# EAGLE design Flasherrev2 (EAGLE 7.5.0)
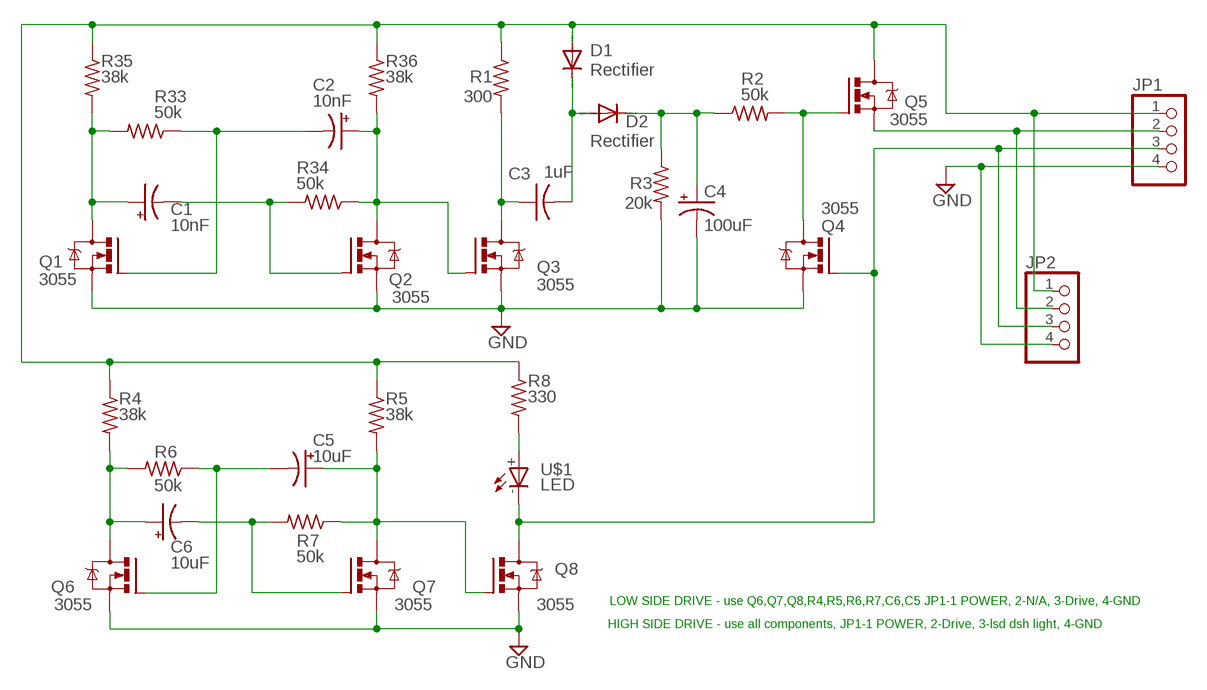
[diagram p0: schematic, sheet 1]

## Parts
C1  10nF  CPOL-USCT3528  [CT3528]
C2  10nF  CPOL-USCT3528  [CT3528]
C3  1uF  CAPACITOR-NO-POLARITYC1206  [C1206]
C4  100uF  CPOL-USF  [PANASONIC_F]
C5  10uF  CPOL-USCT3528  [CT3528]
C6  10uF  CPOL-USCT3528  [CT3528]
D1  Rectifier  DIODE-DO-214AC  [DO-214AC]
D2  Rectifier  DIODE-DO-214AC  [DO-214AC]
JP1  PINHD-1X4  [1X04]
JP2  PINHD-1X4  [1X04]
Q1  3055  MTP3055VSOIC  [SOT223R_INFINEON]
Q2  3055  MTP3055VSOIC  [SOT223R_INFINEON]
Q3  3055  MTP3055VSOIC  [SOT223R_INFINEON]
Q4  3055  MTP3055VSOIC  [SOT223R_INFINEON]
Q5  3055  MTP3055V  [TO220BV]
Q6  3055  MTP3055VSOIC  [SOT223R_INFINEON]
Q7  3055  MTP3055VSOIC  [SOT223R_INFINEON]
Q8  3055  MTP3055V  [TO220BV]
R1  300  RESISITORR1206  [R1206]
R2  50k  RESISITORR1206  [R1206]
R3  20k  RESISITORR1206  [R1206]
R4  38k  RESISITORR1206  [R1206]
R5  38k  RESISITORR1206  [R1206]
R6  50k  RESISITORR1206  [R1206]
R7  50k  RESISITORR1206  [R1206]
R8  330  RESISITORR1206  [R1206]
R33  50k  RESISITORR1206  [R1206]
R34  50k  RESISITORR1206  [R1206]
R35  38k  RESISITORR1206  [R1206]
R36  38k  RESISITORR1206  [R1206]
U$1  LED  [1206]

## Nets
GND: C4.- JP1.4 JP2.4 Q1.3(S) Q2.3(S) Q3.3(S) Q4.3(S) Q6.3(S) Q7.3(S) Q8.S R3.2
N$1: C4.+ D2.C R2.1 R3.1
N$2: C3.2 D1.C D2.A
N$3: JP1.3 JP2.3 Q4.1(G) Q8.D U$1.-
N$4: JP1.2 JP2.2 Q5.S
N$5: R8.2 U$1.+
N$6: Q4.2(D) Q5.G R2.2
N$8: C6.+ Q6.2(D) R4.2 R6.2
N$10: C5.- Q6.1(G) R6.1
N$11: C1.+ Q1.2(D) R33.2 R35.2
N$12: C2.+ Q2.2(D) Q3.1(G) R34.1 R36.2
N$13: C6.- Q7.1(G) R7.2
N$14: C2.- Q1.1(G) R33.1
N$15: C1.- Q2.1(G) R34.2
N$18: C5.+ Q7.2(D) Q8.G R5.2 R7.1
N$37: D1.A JP1.1 JP2.1 Q5.D R1.1 R4.1 R5.1 R8.1 R35.1 R36.1
N$42: C3.1 Q3.2(D) R1.2

## Notes on the sheet
- LOW SIDE DRIVE - use Q6,Q7,Q8,R4,R5,R6,R7,C6,C5 JP1-1 POWER, 2-N/A, 3-Drive, 4-GND
- HIGH SIDE DRIVE - use all components, JP1-1 POWER, 2-Drive, 3-lsd dsh light, 4-GND

## Library data of the parts
C1 C2 C4-C6 = rcl:CPOL-US: POLARIZED CAPACITOR, American symbol
C3 = 1 Dan's Common Parts:CAPACITOR-NO-POLARITY: CAPACITOR, American symbol
D1 D2 = diode:DIODE-: DIODE
JP1 JP2 = pinhead:PINHD-1X4: PIN HEADER
Q1-Q8 = 1 Dan's Common Parts:MTP3055V: N-CHANNEL MOS FET
R1-R8 R33-R36 = 1 Dan's Common Parts:RESISITOR: RESISTOR, American symbol
U$1 = 1 Dan's Common Parts:LED

## Board
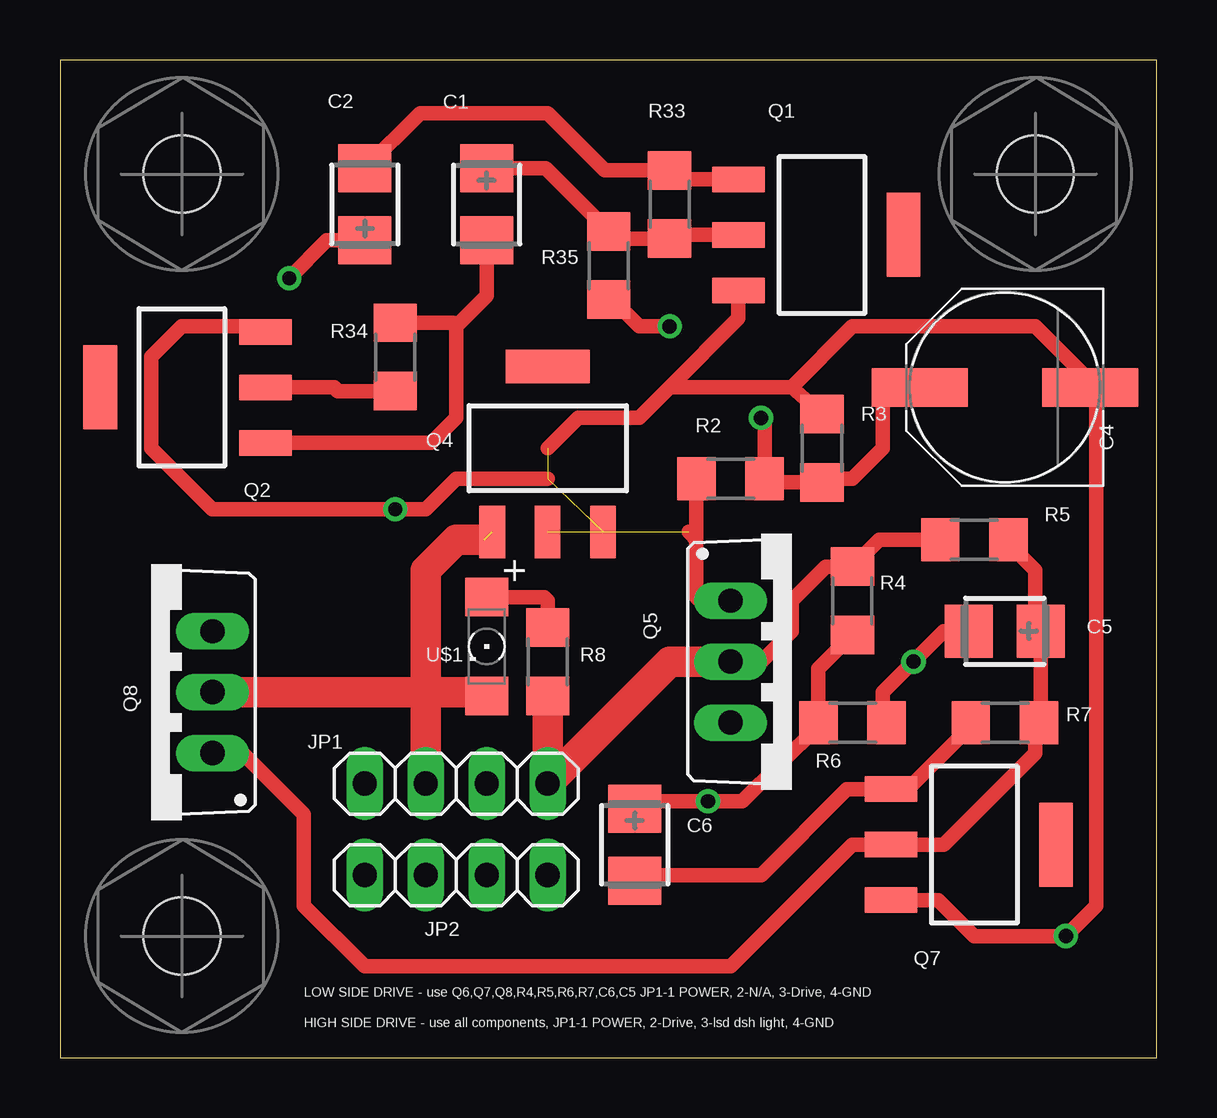
[diagram p1: board, top side]
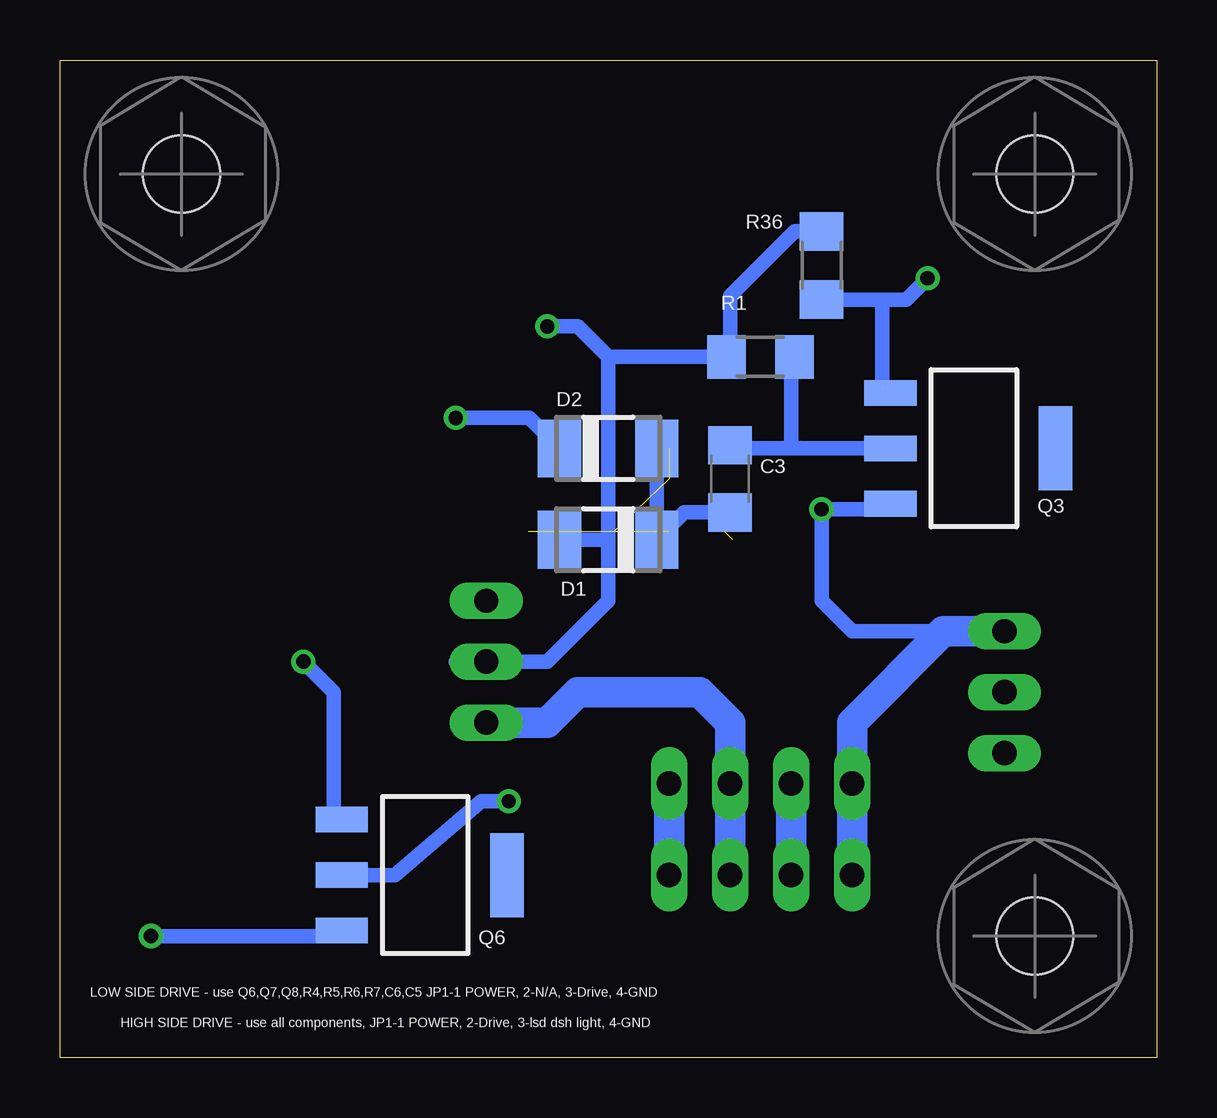
[diagram p2: board, bottom side, seen from below]

Size 45.7 x 41.58 mm. Coordinates in mm from the lower left corner, seen from the top.
Outline: 0,0 45.7,0 45.7,41.58 0,41.58 0,0
Copper layers (1*16): Top 0.035mm / dielectric 1.5mm / Bottom 0.035mm
Design rules "default *": minimum track width 10mil, minimum drill 20mil, track to track 8mil, track to pad 8mil, pad to pad 8mil, via to via 8mil, smd to smd 8mil, copper to edge 40mil, drill to drill 8mil, minimum pad ring 10mil, minimum via ring 8mil, stop-mask expansion 4mil, vias tented up to drill 0mil, thermal gap 10mil

### Footprints (pad centres in the part's own frame; a part is rotated, then mirrored left to right if it is on the bottom)
CT3528 = smd 2 x 2.2: + 1.5,0; - -1.5,0
C1206 = smd 1.6 x 1.8: 1 -1.4,0; 2 1.4,0
PANASONIC_F = smd 4 x 1.6: + 3.55,0; - -3.55,0
DO-214AC = smd 1.8 x 2.4: A 2.025,0; C -2.025,0
1X04 = drill 1.016 long: 1 -3.81,0; 2 -1.27,0; 3 1.27,0; 4 3.81,0
SOT223R_INFINEON = smd 1.067 x 2.184: 1 -2.311,-3.479; 2 0,-3.48; 3 2.312,-3.48 | smd 3.5 x 1.4: 4 0,3.404
TO220BV = drill 1.016 long: D 0,-2.54; G -2.54,-2.54; S 2.54,-2.54
R1206 = smd 1.6 x 1.803: 1 -1.422,0; 2 1.422,0
1206 = smd 1.6 x 1.803: + -1.422,0; - 2.692,0
SCREW = hole 3.2: 0,0

### Placement (x,y rotation side)
C1  17.78,35.56 90 top
C2  12.7,35.56 270 top
C3  17.78,24.13 270 bottom
C4  39.37,27.94 180 top
C5  39.37,17.78 0 top
C6  23.95,8.89 90 top
D1  22.86,21.59 180 bottom
D2  22.86,25.4 0 bottom
JP1  16.51,11.43 180 top
JP2  16.51,7.62 180 top
Q1  31.75,34.29 270 top
Q2  5.08,27.94 90 top
Q3  7.62,25.4 270 bottom
Q4  20.32,25.4 0 top
Q5  30.48,16.51 270 top
Q6  30.48,7.62 270 bottom
Q7  38.1,8.89 270 top
Q8  3.81,15.24 90 top
R1  16.51,29.21 0 bottom
R2  27.94,24.13 180 top
R3  31.75,25.4 90 top
R4  33.02,19.05 270 top
R5  38.1,21.59 0 top
R6  33.02,13.97 180 top
R7  39.37,13.97 180 top
R8  20.32,16.51 90 top
R33  25.4,35.56 270 top
R34  13.97,29.21 90 top
R35  22.86,33.02 90 top
R36  13.97,33.02 270 bottom
U$1  17.78,17.78 270 top
U$2  [SCREW]  5.08,5.08 0 top
U$3  [SCREW]  5.08,36.83 0 top
U$4  [SCREW]  40.64,36.83 0 top

### Tracks (layer width: path | path; a pad name or v marks a point on that pad's centre or on a via)
GND  (via drill 0.6)  (2 unrouted)
  Top 0.61: Q2.3 8.33,30.48 5.08,30.48 3.81,29.21 3.81,25.4 6.35,22.86 v13.97,22.86 15.24,22.86 16.51,24.13 20.32,24.13 | 20.32,25.4 21.59,26.67 24.13,26.67 25.4,27.94 | 20.32,24.13 | Q7.3 36.6,6.58 38.1,5.08 v41.91,5.08 43.18,6.35 43.18,27.68 C4.- 42.92,28.2 40.64,30.48 33.02,30.48 30.48,27.94 | Q1.3 28.27,30.81 25.4,27.94 | R3.2 30.48,27.94 | 30.48,27.94 25.4,27.94
  Bottom 0.61: v41.91,5.08 34.29,5.08 | 34.29,5.08 34.19,5.08 Q6.3 34.06,5.31 34.29,5.08 | Q3.3 11.33,22.86 v13.97,22.86 13.97,19.05 12.7,17.78 Q8.S
  Bottom 1.27: Q8.S 8.89,17.78 12.7,13.97 JP1.4 JP2.4
N$1  (via drill 0.6)
  Top 0.61: v29.21,26.67 29.36,26.52 R2.1 29.36,23.98 R3.1 31.9,24.13 33.02,24.13 34.29,25.4 34.29,27.94 C4.+
  Bottom 0.61: D2.C 26.16,26.67 v29.21,26.67
N$2
  Bottom 0.61: D2.A D1.C 19.7,22.73 C3.2
N$3  (1 unrouted)
  Top 1.27: JP1.3 15.24,15.24 | 15.24,15.24 Q8.D | U$1.- 17.63,15.24 | 17.78,15.24 17.63,15.24 | 17.63,15.24 15.24,15.24 | 15.24,15.24 15.24,20.32 16.51,21.59 17.68,21.59
  Bottom 1.27: JP2.3 JP1.3
N$4
  Bottom 1.27: Q5.S 25.4,13.97 24.13,15.24 19.05,15.24 17.78,13.97 JP1.2 JP2.2
N$5
  Top 0.61: U$1.+ 20.17,19.2 20.32,19.05 R8.2
N$6  (1 unrouted)
  Top 0.61: R2.2 26.52,21.59 | 26.52,21.59 26.52,19.2 26.67,19.05 Q5.G | 26.19,21.92 26.52,21.59
N$8  (via drill 0.6)
  Top 0.61: R4.2 31.6,16.21 R6.2 31.6,13.82 28.42,10.69 v27,10.69 24.99,10.69 C6.+
  Bottom 0.61: Q6.2 31.75,7.62 28.14,10.69 v27,10.69
N$10  (via drill 0.6)
  Top 0.61: R6.1 34.29,13.97 34.29,15.24 v35.56,16.51 36.83,17.78 C5.-
  Bottom 0.61: v35.56,16.51 34.29,15.24 34.29,10.16 34.19,10.16 Q6.1
N$11
  Top 0.61: Q1.2 25.55,34.29 R33.2 23.16,34.14 R35.2 20.24,37.06 C1.+
N$12  (via drill 0.6)  (1 unrouted)
  Top 0.61: R34.1 11.58,27.79 11.43,27.94 Q2.2 | 12.7,34.29 C2.+ 11.12,34.06 v9.55,32.49
  Bottom 0.61: 11.43,28.04 Q3.1 11.1,27.94 11.43,27.94 11.43,31.6 | R36.2 11.43,31.6 | 11.43,31.6 10.44,31.6 v9.55,32.49
N$13
  Top 0.61: R7.2 37.95,13.82 35.56,11.43 34.85,11.43 Q7.1 32.79,11.2 29.21,7.62 24.36,7.62 C6.-
N$14
  Top 0.61: Q1.1 25.78,36.6 R33.1 22.71,36.98 20.32,39.37 15.01,39.37 C2.-
N$15
  Top 0.61: Q2.1 15.47,25.63 16.51,26.67 16.51,30.48 | R34.2 16.36,30.63 16.51,30.48 | C1.- 17.78,31.75 16.51,30.48
N$18
  Top 0.61: Q8.G 7.62,12.7 10.16,10.16 10.16,6.35 12.7,3.81 27.94,3.81 33.02,8.89 Q7.2 36.83,8.89 40.64,12.7 40.64,13.82 R7.1 40.87,14.05 C5.+ 40.64,18.01 40.64,20.32 39.52,21.44 R5.2
N$37  (via drill 0.6)
  Top 0.61: Q5.D 29.21,16.51 30.48,17.78 30.48,19.05 31.9,20.47 R4.1 34.14,21.59 R5.1 | R35.1 23.01,31.6 24.13,30.48 v25.4,30.48
  Top 1.27: Q5.D 25.4,16.51 JP1.1 R8.1
  Bottom 0.61: 22.86,29.21 22.86,21.59 | 22.86,21.59 22.86,19.05 25.4,16.51 Q5.D 29.21,16.51 | 22.86,29.21 R1.1 17.78,29.36 17.78,31.75 15.09,34.44 R36.1 | D1.A 22.86,21.59 | 22.86,29.21 24.13,30.48 v25.4,30.48
  Bottom 1.27: JP2.1 JP1.1
N$42
  Bottom 0.61: Q3.2 12.7,25.4 15.24,25.4 | 15.24,25.4 15.24,29.06 R1.2 | 15.24,25.4 17.65,25.4 C3.1

### Text on the board
tNames: LOW SIDE DRIVE - use Q6,Q7,Q8,R4,R5,R6,R7,C6,C5 JP1-1 POWER, 2-N/A, 3-Drive, 4-GND | HIGH SIDE DRIVE - use all components, JP1-1 POWER, 2-Drive, 3-lsd dsh light, 4-GND
bNames: LOW SIDE DRIVE - use Q6,Q7,Q8,R4,R5,R6,R7,C6,C5 JP1-1 POWER, 2-N/A, 3-Drive, 4-GND | HIGH SIDE DRIVE - use all components, JP1-1 POWER, 2-Drive, 3-lsd dsh light, 4-GND